# Altium schematic sheet Peripherals.SchDoc: Peripherals
size Letter; Revision: 1.0; SheetNumber: 4; PageSetup: Record=PageOptions|CenterHorizontal=True|CenterVertical=True|PrintScale=1.00|XCorrection=1.00|YCorrection=1.00|PrintKind=1|BorderSize=5000000|LeftOffset=0|BottomOffset=0|Orientation=2|PaperLength=1000|PaperWidth=1000|Scale=100|PaperSource=7|PrintQuality=-3|MediaType=1|DitherType=10|PrintScaleMode=1|PaperKind=Letter|PaperIndex=1; ProjectTitle: Data Acquisition System
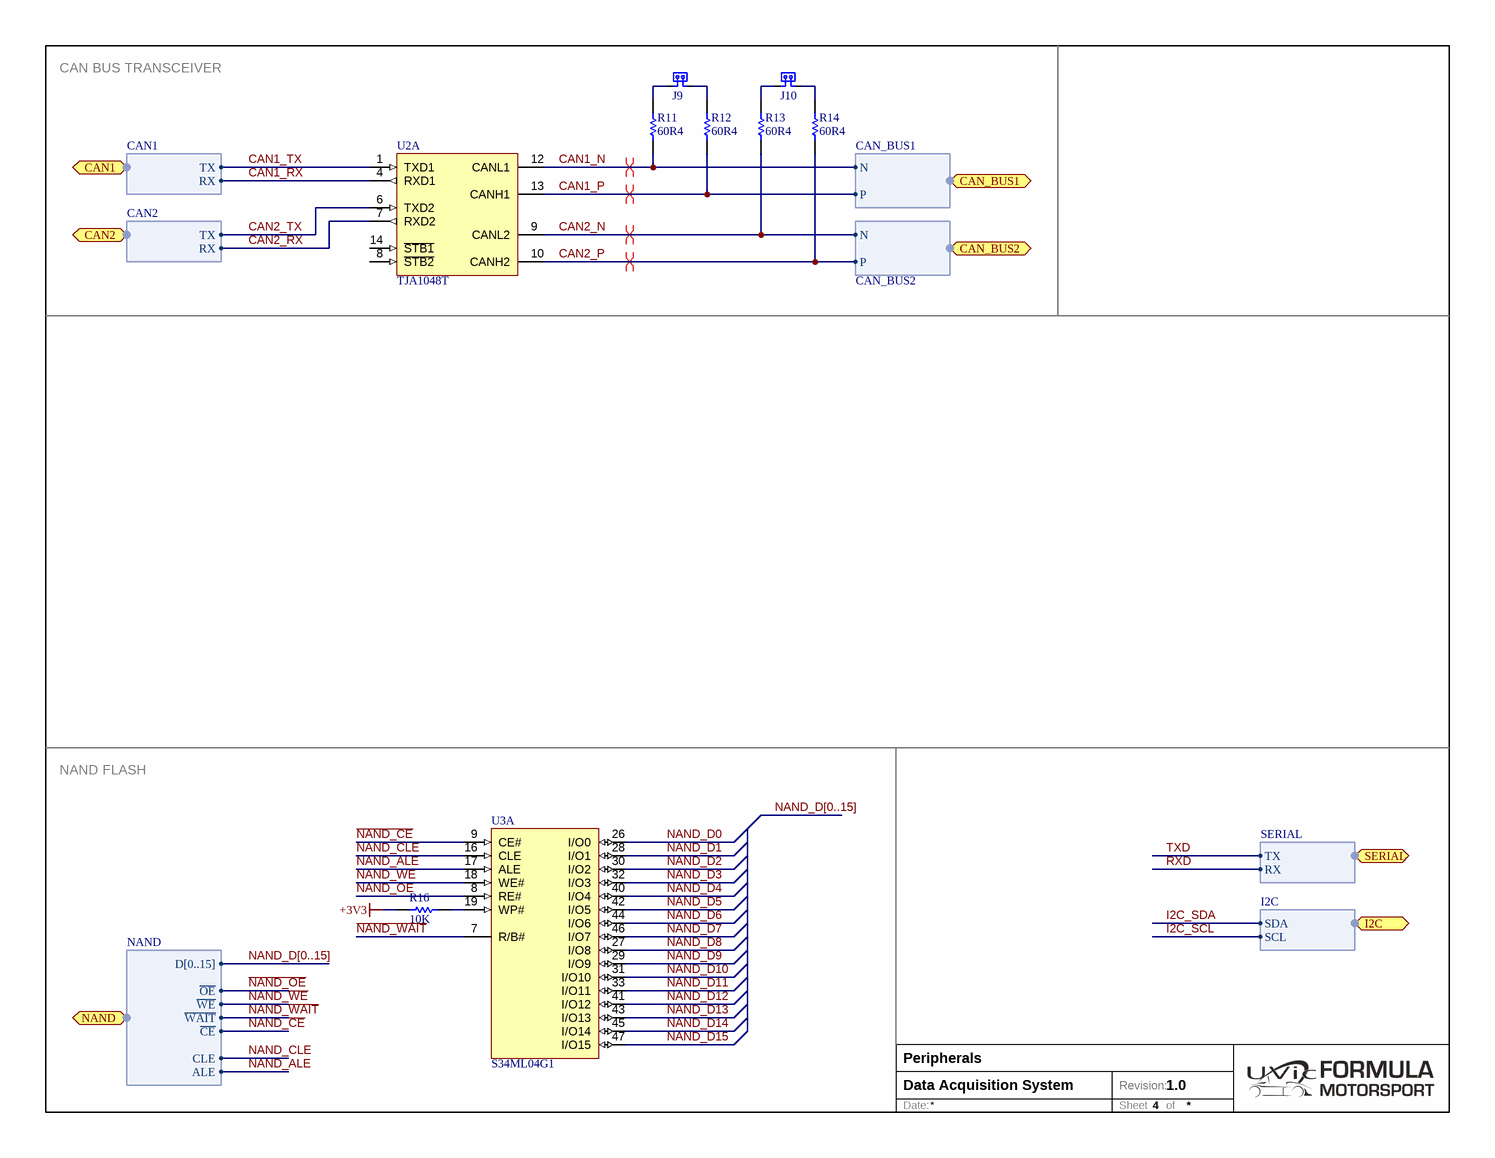
[diagram p0: Peripherals.SchDoc]

## Parts
J9  M20-9990246  [M20-9990246]  (value not drawn)
J10  M20-9990246  [M20-9990246]  (value not drawn)
R11  value 60R4  [RES-1206-M]  (hidden comment: Resistor 60R4 1/4 W 1206)
R12  value 60R4  [RES-1206-M]  (hidden comment: Resistor 60R4 1/4 W 1206)
R13  value 60R4  [RES-1206-M]  (hidden comment: Resistor 60R4 1/4 W 1206)
R14  value 60R4  [RES-1206-M]  (hidden comment: Resistor 60R4 1/4 W 1206)
R16  value 10K  [RES-0603-M]  (hidden comment: Resistor 10K 1/10 W 0603)
U2  TJA1048T  [SOP127P600X175-14N]  (part A of 2)
U3  S34ML04G1  [48-TSOP]  (part A of 2)

## Ports
CAN1 (harness CAN1), CAN2 (harness CAN2), CAN_BUS1 (harness CAN_BUS1), CAN_BUS2 (harness CAN_BUS2), I2C (harness I2C), NAND (harness NAND), SERIAL (harness SERIAL)

## Harnesses
CAN1: TX, RX
CAN2: TX, RX
NAND: D[0..15], ~{OE}, ~{WE}, ~{WAIT}, ~{CE}, CLE, ALE
CAN_BUS1: N, P
CAN_BUS2: N, P
I2C: SDA, SCL
SERIAL: TX, RX

## Nets
+3V3: R16.2
CAN1_N: R11.2 U2.12(CANL1) ; port CAN_BUS1.N
CAN1_P: R12.2 U2.13(CANH1) ; port CAN_BUS1.P
CAN1_RX: U2.4(RXD1) ; port CAN1.RX
CAN1_TX: U2.1(TXD1) ; port CAN1.TX
CAN2_N: R13.2 U2.9(CANL2) ; port CAN_BUS2.N
CAN2_P: R14.2 U2.10(CANH2) ; port CAN_BUS2.P
CAN2_RX: U2.7(RXD2) ; port CAN2.RX
CAN2_TX: U2.6(TXD2) ; port CAN2.TX
I2C_SCL: port I2C.SCL
I2C_SDA: port I2C.SDA
~{NAND_CE}: U3.9(CE#) ; port NAND.~{CE}
~{NAND_OE}: U3.8(RE#) ; port NAND.~{OE}
~{NAND_WAIT}: U3.7(R/B#) ; port NAND.~{WAIT}
~{NAND_WE}: U3.18(WE#) ; port NAND.~{WE}
NAND_ALE: U3.17(ALE) ; port NAND.ALE
NAND_CLE: U3.16(CLE) ; port NAND.CLE
NAND_D0: U3.26(I/O0)
NAND_D1: U3.28(I/O1)
NAND_D2: U3.30(I/O2)
NAND_D3: U3.32(I/O3)
NAND_D4: U3.40(I/O4)
NAND_D5: U3.42(I/O5)
NAND_D6: U3.44(I/O6)
NAND_D7: U3.46(I/O7)
NAND_D8: U3.27(I/O8)
NAND_D9: U3.29(I/O9)
NAND_D10: U3.31(I/O10)
NAND_D11: U3.33(I/O11)
NAND_D12: U3.41(I/O12)
NAND_D13: U3.43(I/O13)
NAND_D14: U3.45(I/O14)
NAND_D15: U3.47(I/O15)
RXD: port SERIAL.RX
TXD: port SERIAL.TX
NetJ9_1: J9.1 R11.1
NetJ9_2: J9.2 R12.1
NetJ10_1: J10.1 R13.1
NetJ10_2: J10.2 R14.1
NetR16_1: R16.1 U3.19(WP#)

Not connected (* = marked no-connect by the designer): U2 8(~{STB2}) 14(~{STB1})

## Buses and harness runs
bus NAND_D[0..15]

## Layout directives
differential pair: CAN1_N, CAN1_P, CAN2_N, CAN2_P

## Notes on the sheet
- CAN BUS TRANSCEIVER
- NAND FLASH
- Date:
- Revision:
- Sheet
- of

## Library data of the parts
J9 J10 = JUMPER-1: 2.54mm Header Jumper; Supplier 1: Digi-Key; Supplier Part Number 1: 952-2262-ND
R11-R14 = RC1206FR-0760R4L: Manufacturer: Yageo; Manufacturer Series: RC; Tolerance: ±1%; Power: 1/4 W; Temperature Coefficient: ±100ppm/°C; Part Number: RC1206FR-0760R4L; Component Type: Standard; Package: 1206; Temperature Range: -55°C ~ 155°C; Supplier 1: Digi-Key; Supplier Part Number 1: 311-60.4FRCT-ND
R16 = RC0603FR-0710KL: Manufacturer: Yageo; Manufacturer Series: RC; Tolerance: 1%; Power: 1/10 W; Temperature Coefficient: ±100ppm/°C; Part Number: RC0603FR-0710KL; Component Type: Standard; Package: 0603; Temperature Range: -55°C ~ 155°C; Supplier 1: Digi-Key; Supplier Part Number 1: 311-10.0KHRCT-ND
U2 = TJA1048T: Dual CAN transceiver; Supplier 1: Digi-Key; Supplier Part Number 1: 568-8681-1-ND